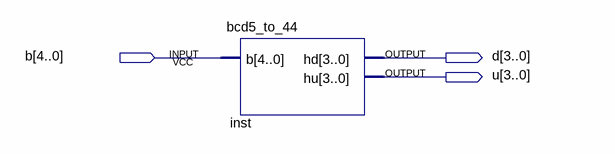
[diagram p0: schematic sheet]
// Quartus schematic bcd5_to_44_test.bdf as structural Verilog: 1 symbols, 3 pins
module bcd5_to_44_test (
  input  [4:0] b,
  output [3:0] d,
  output [3:0] u
);

  bcd5_to_44 inst (.b(b), .hd(d), .hu(u));
endmodule
